# EAGLE design ELEC327_V3 (EAGLE 9.6.2)

## Sheet 1 of 2

## Sheet 2 of 2
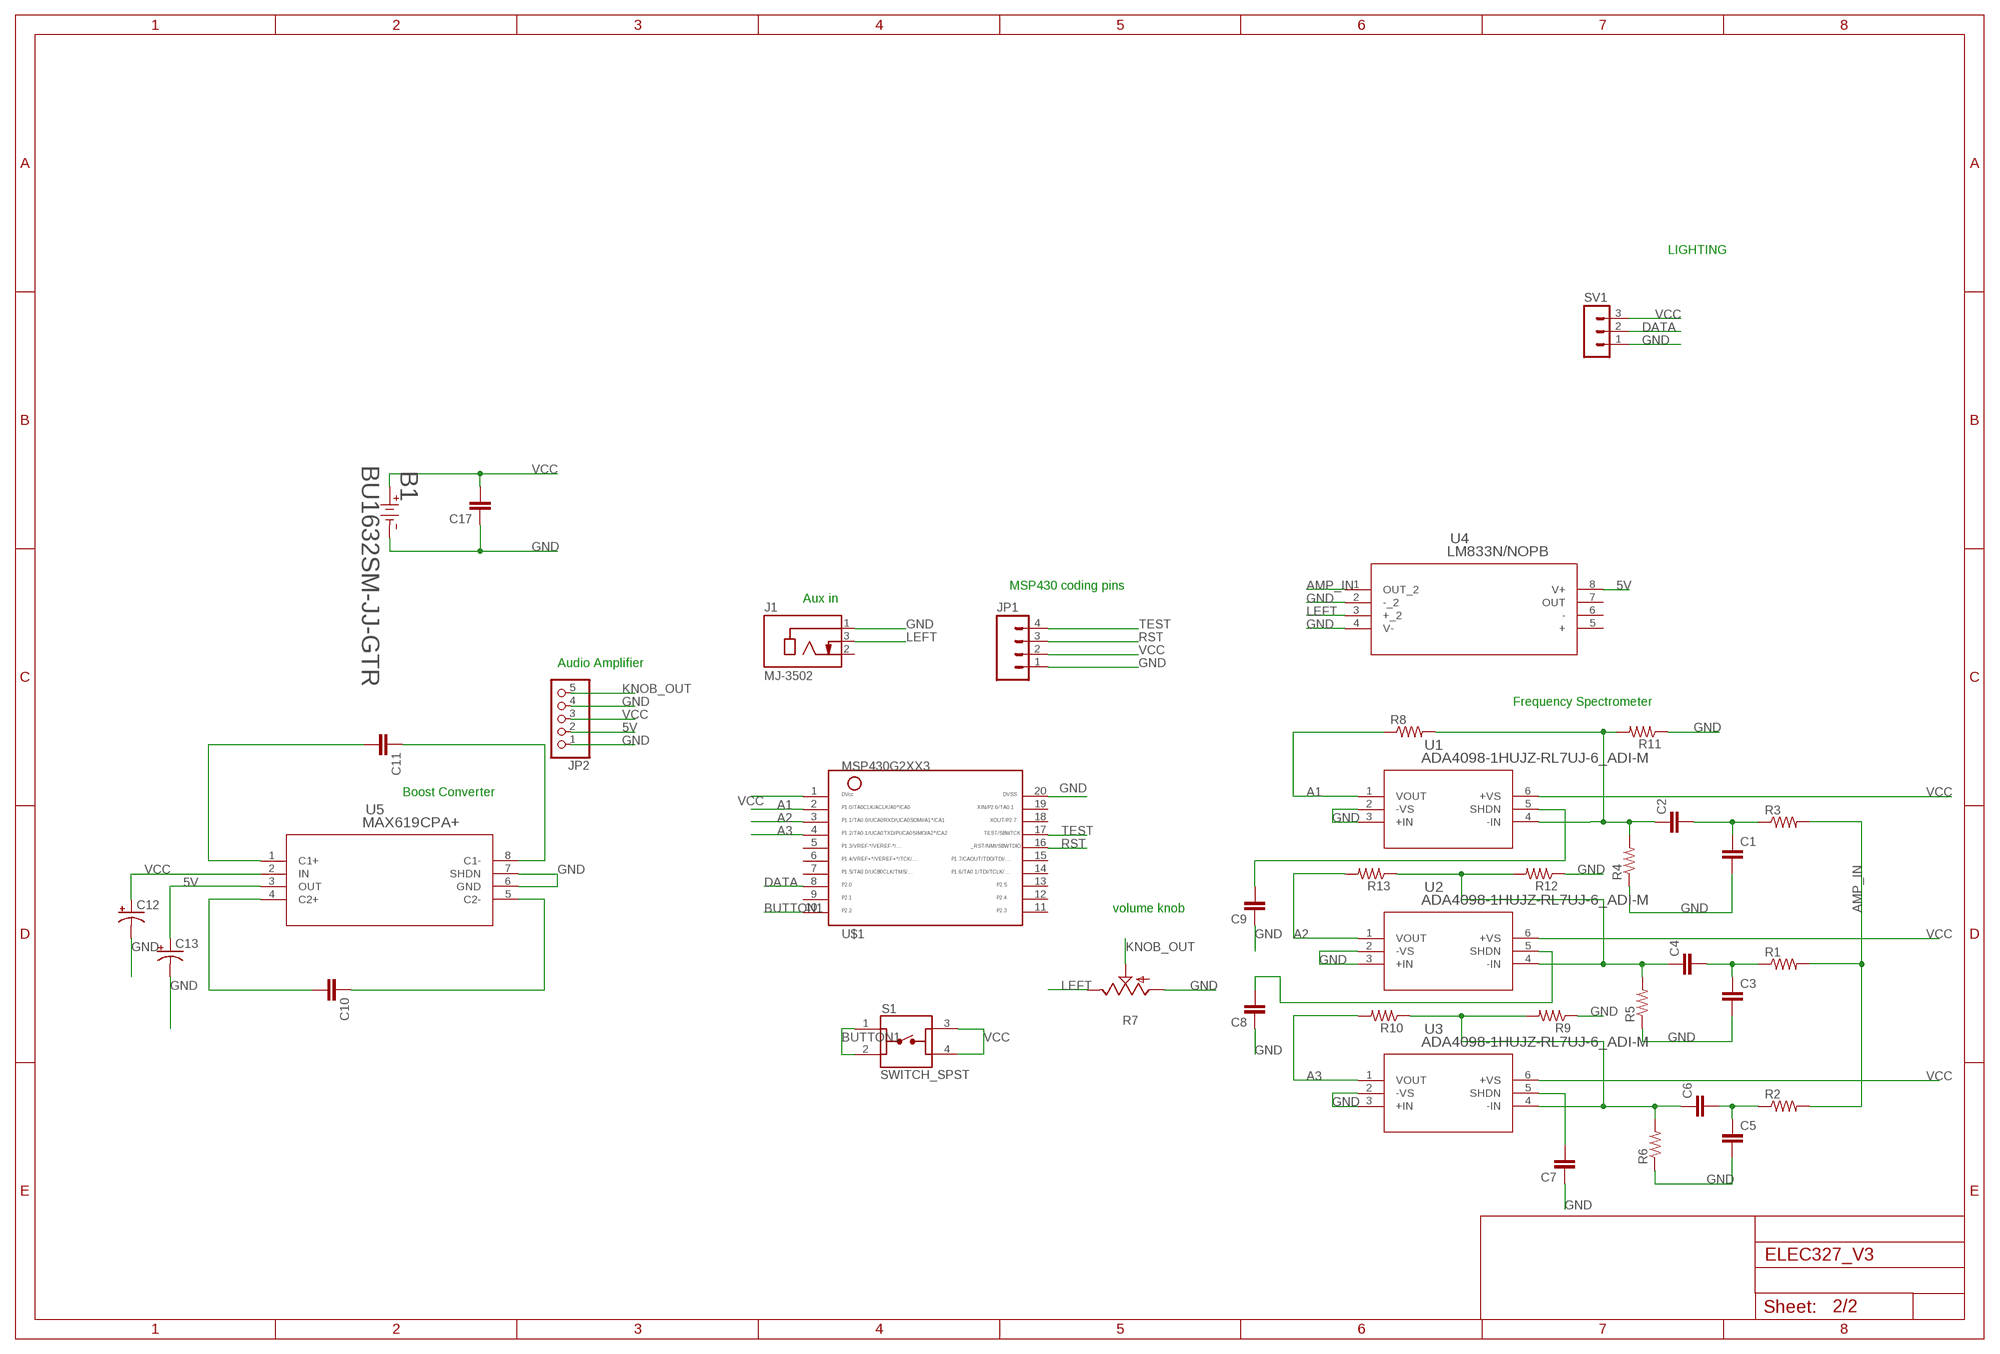
[diagram p0: schematic, sheet 2]

### Parts
B1  BU1632SM-JJ-GTR  [BU1632SM-JJ-GTR_MPD]
C1  C-EUC1206  [C1206]
C2  C-EUC1206  [C1206]
C3  C-EUC1206  [C1206]
C4  C-EUC1206  [C1206]
C5  C-EUC1206  [C1206]
C6  C-EUC1206  [C1206]
C7  C-EUC1206  [C1206]
C8  C-EUC1206  [C1206]
C9  C-EUC1206  [C1206]
C10  C-EUC1206  [C1206]
C11  C-EUC1206  [C1206]
C12  CPOL-USE5-6  [E5-6]
C13  CPOL-USE5-6  [E5-6]
C17  C-EUC1206  [C1206]
J1  MJ-3502  [CUI_MJ-3502]
JP1  HEADER_1X04LOCK  [1X04_LOCK]
JP2  PINHD-1X55X2MM  [1_05X2MM]
R1  R-US_R1206  [R1206]
R2  R-US_R1206  [R1206]
R3  R-US_R1206  [R1206]
R4  R-US_R1206  [R1206]
R5  R-US_R1206  [R1206]
R6  R-US_R1206  [R1206]
R7  TRIM_US-B25X  [B25X]
R8  R-US_R1206  [R1206]
R9  R-US_R1206  [R1206]
R10  R-US_R1206  [R1206]
R11  R-US_R1206  [R1206]
R12  R-US_R1206  [R1206]
R13  R-US_R1206  [R1206]
S1  SWITCH_SPST  [SW_1825910-7]
SV1  MA03-1  [MA03-1]
U1  ADA4098-1HUJZ-RL7UJ-6_ADI-M  [UJ-6_ADI-M]
U2  ADA4098-1HUJZ-RL7UJ-6_ADI-M  [UJ-6_ADI-M]
U3  ADA4098-1HUJZ-RL7UJ-6_ADI-M  [UJ-6_ADI-M]
U4  LM833N/NOPB  [N08E_TEX]
U5  MAX619CPA+  [21-0043D_8_MXM]
U$1  MSP430G2XX3TSSOP  [PW20]

### Nets
5V: C13.+ JP2.2 U4.8(V+) U5.3(OUT)
A1: R8.1 U1.1(VOUT) U$1.2
A2: R13.2 U2.1(VOUT) U$1.3
A3: R10.2 U3.1(VOUT) U$1.4
AMP_IN: R1.2 R2.2 R3.2 U4.1(OUT_2)
BUTTON1: S1.1 S1.2 U$1.10
DATA: SV1.2 U$1.8
GND: B1.2 C1.2 C3.2 C5.2 C7.1 C8.1 C9.1 C12.- C13.- C17.1 J1.1 JP1.1 JP2.1 JP2.4 R4.1 R5.1 R6.1 R7.A R9.1 R11.1 R12.1 SV1.1 U1.2(-VS) U1.3(+IN) U2.2(-VS) U2.3(+IN) U3.2(-VS) U3.3(+IN) U4.2(-_2) U4.4(V-) U5.6(GND) U5.7(SHDN) U$1.20
KNOB_OUT: JP2.5 R7.S
LEFT: J1.3 R7.E U4.3(+_2)
N$1: C2.1 R4.2 R8.2 R11.2 U1.4(-IN)
N$2: C1.1 C2.2 R3.1
N$3: C3.1 C4.2 R1.1
N$4: C5.1 C6.2 R2.1
N$5: C4.1 R5.2 R12.2 R13.1 U2.4(-IN)
N$6: C7.2 U3.5(SHDN)
N$7: C6.1 R6.2 R9.2 R10.1 U3.4(-IN)
N$8: C8.2 U2.5(SHDN)
N$9: C9.2 U1.5(SHDN)
N$10: C10.2 U5.4(C2+)
N$11: C10.1 U5.5(C2-)
N$12: C11.2 U5.1(C1+)
N$13: C11.1 U5.8(C1-)
RST: JP1.3 U$1.16
TEST: JP1.4 U$1.17
VCC: B1.1 C12.+ C17.2 JP1.2 JP2.3 S1.3 S1.4 SV1.3 U1.6(+VS) U2.6(+VS) U3.6(+VS) U5.2(IN) U$1.1
Unconnected: J1.2 U4.5(+) U4.6(-) U4.7(OUT) U$1.5 U$1.6 U$1.7 U$1.9 U$1.11 U$1.12 U$1.13 U$1.14 U$1.15 U$1.18 U$1.19

### Notes on the sheet
- LIGHTING
- MSP430 coding pins
- Aux in
- Audio Amplifier
- Frequency Spectrometer
- Boost Converter
- volume knob

## Library data of the parts
B1 = ELEC327:BU1632SM-JJ-GTR; COPYRIGHT: Copyright (C) 2023 Ultra Librarian. All rights reserved.; MANUFACTURER_PART_NUMBER: BU1632SM-JJ-GTR; MFR_NAME: Memory Protection Devices
C1-C11 C17 = rcl:C-EU: CAPACITOR, European symbol; SPICEPREFIX: C
C12 C13 = rcl:CPOL-US: POLARIZED CAPACITOR, American symbol; SPICEPREFIX: C
J1 = MJ-3502:MJ-3502: 3.5 mm, Mono, Right Angle, Through Hole, Threaded Bushing, Audio Jack Connector; MANUFACTURER: CUI INC; PART_REV: A; STANDARD: MANUFACTURER RECOMMENDATIONS
JP1 = ELEC327:HEADER_1X04: Header 4 Standard 4-pin 0.1" header. Use with straight break away headers (SKU : PRT-00116), right angle break away headers (PRT-00553), swiss pins (PRT-00743), machine pins (PRT-00117), and female headers (PRT-00115). Molex polarized connector foot print use with SKU : PRT-08231 with associated crimp pins and housings.
JP2 = pinhead:PINHD-1X5: PIN HEADER
R1-R6 R8-R13 = rcl:R-US_: RESISTOR, American symbol; SPICEPREFIX: R
R7 = pot:TRIM_US-: POTENTIOMETER
S1 = ELEC327:SWITCH_SPST: TE Connectivity Alcoswitch, 6mm Switch Tactile OFF (ON) SPST Round Button PC Pins 0.05A 24VDC 100000Cycles 2.55N Thru-Hole Loose Through Hole Version 1825910-7 <https://www.digikey.com/en/products/detail/te-connectivity-alcoswitch-switches/1825910-7/1731414> Surface Mount Version 1571563-4 <https://www.digikey.com/en/products/detail/te-connectivity-alcoswitch-switches/1571563-4/2400231>; COMMENT: 1825910-7; CONFIGURATION_POLE-THROW: Single Pole - Single Throw; CONTACT_CURRENT_RATING: 50 mA; DESCRIPTION: Switch Tactile OFF (ON) SPST Round Button PC Pins 0.05A 24VDC 100000Cycle 2.55N Thru-Hole Loose Piece; DIGI-KEY_PART_NUMBER: 450-1804-ND; EU_ROHS_COMPLIANCE: Compliant; MF: TE Connectivity; MP: 1825910-7; PACKAGE: None; PURCHASE-URL: https://pricing.snapeda.com/search/part/1825910-7/?ref=eda
SV1 = con-lstb:MA03-1: PIN HEADER; OC_FARNELL: unknown; OC_NEWARK: unknown
U1-U3 = ADA4098:ADA4098-1HUJZ-RL7; COPYRIGHT: Copyright (C) 2023 Ultra Librarian. All rights reserved.; MANUFACTURER_PART_NUMBER: ADA4098-1HUJZ-RL7; MFR_NAME: Analog Devices Inc
U4 = LM833N:LM833N/NOPB; COPYRIGHT: Copyright (C) 2023 Ultra Librarian. All rights reserved.; MANUFACTURER_PART_NUMBER: LM833N/NOPB; MFR_NAME: Texas Instruments
U5 = ul_MAX619CPA-:MAX619CPA+; COPYRIGHT: Copyright (C) 2023 Ultra Librarian. All rights reserved.; MANUFACTURER_PART_NUMBER: MAX619CPA+; MFR_NAME: Analog Devices Inc
U$1 = ELEC327:MSP430G2XX3: MSP430G2XX3 PDIP (N) 20 Pin Package

## Board
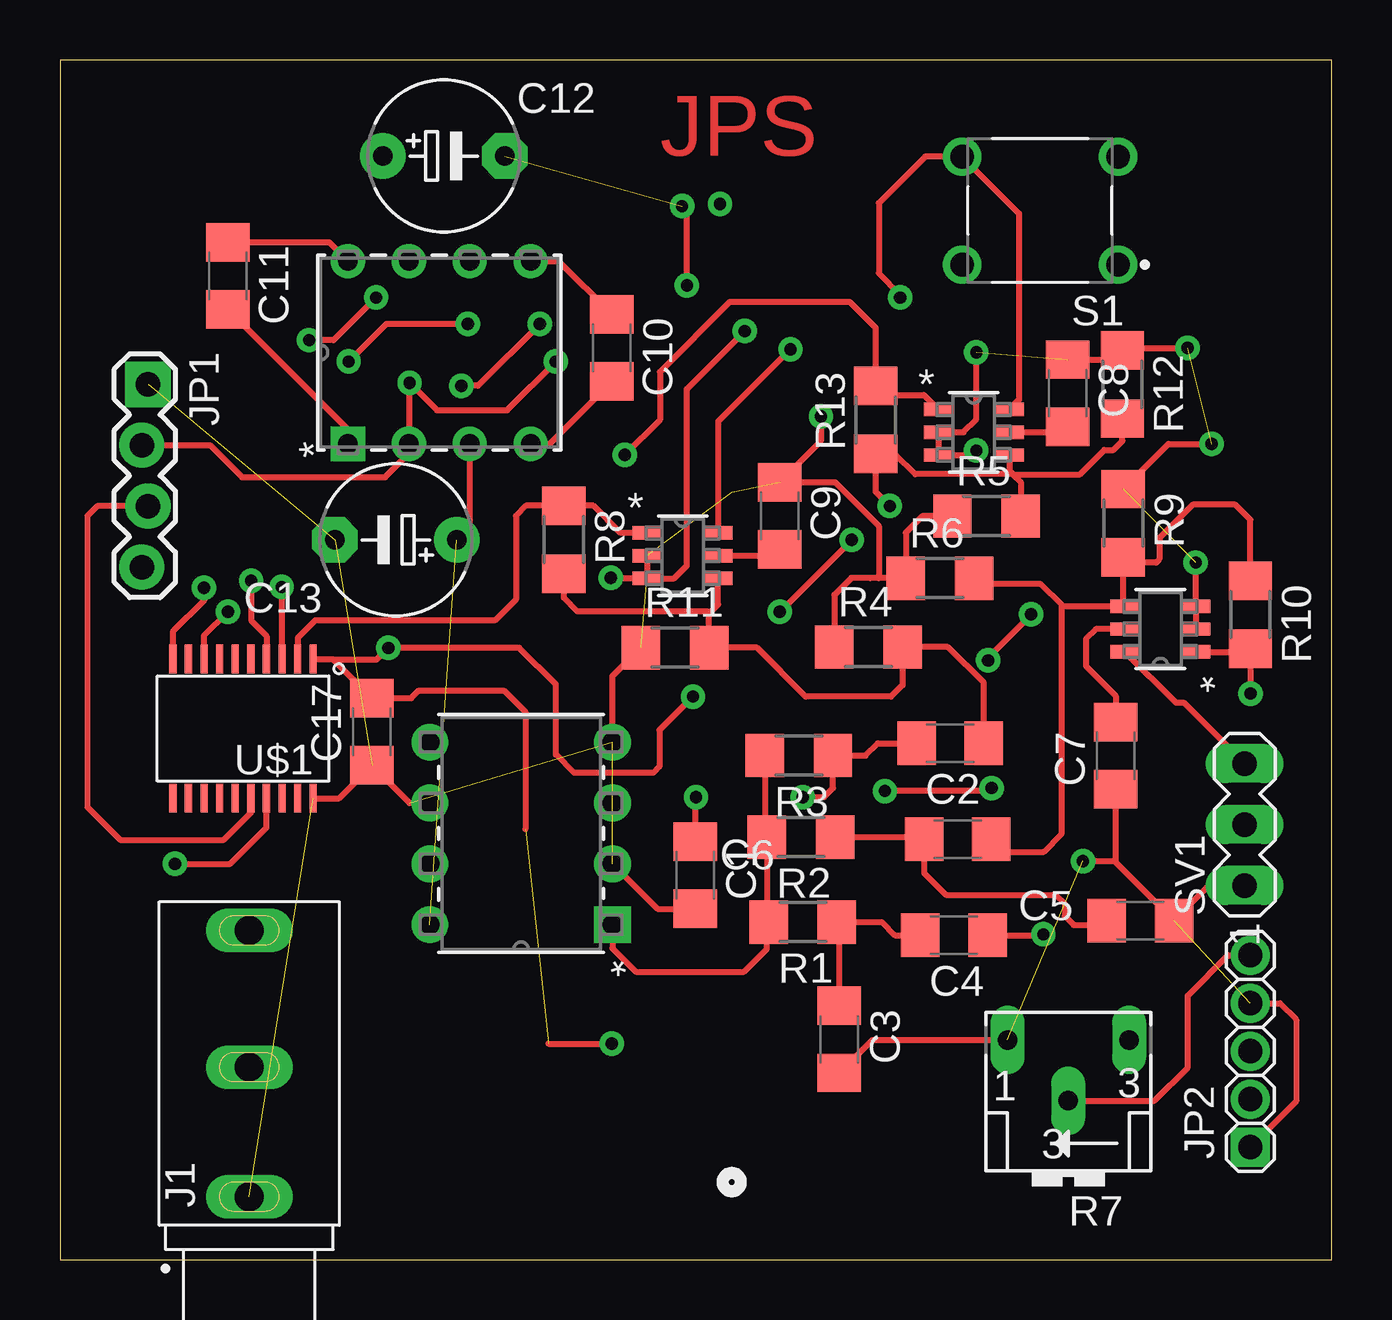
[diagram p1: board, top side]
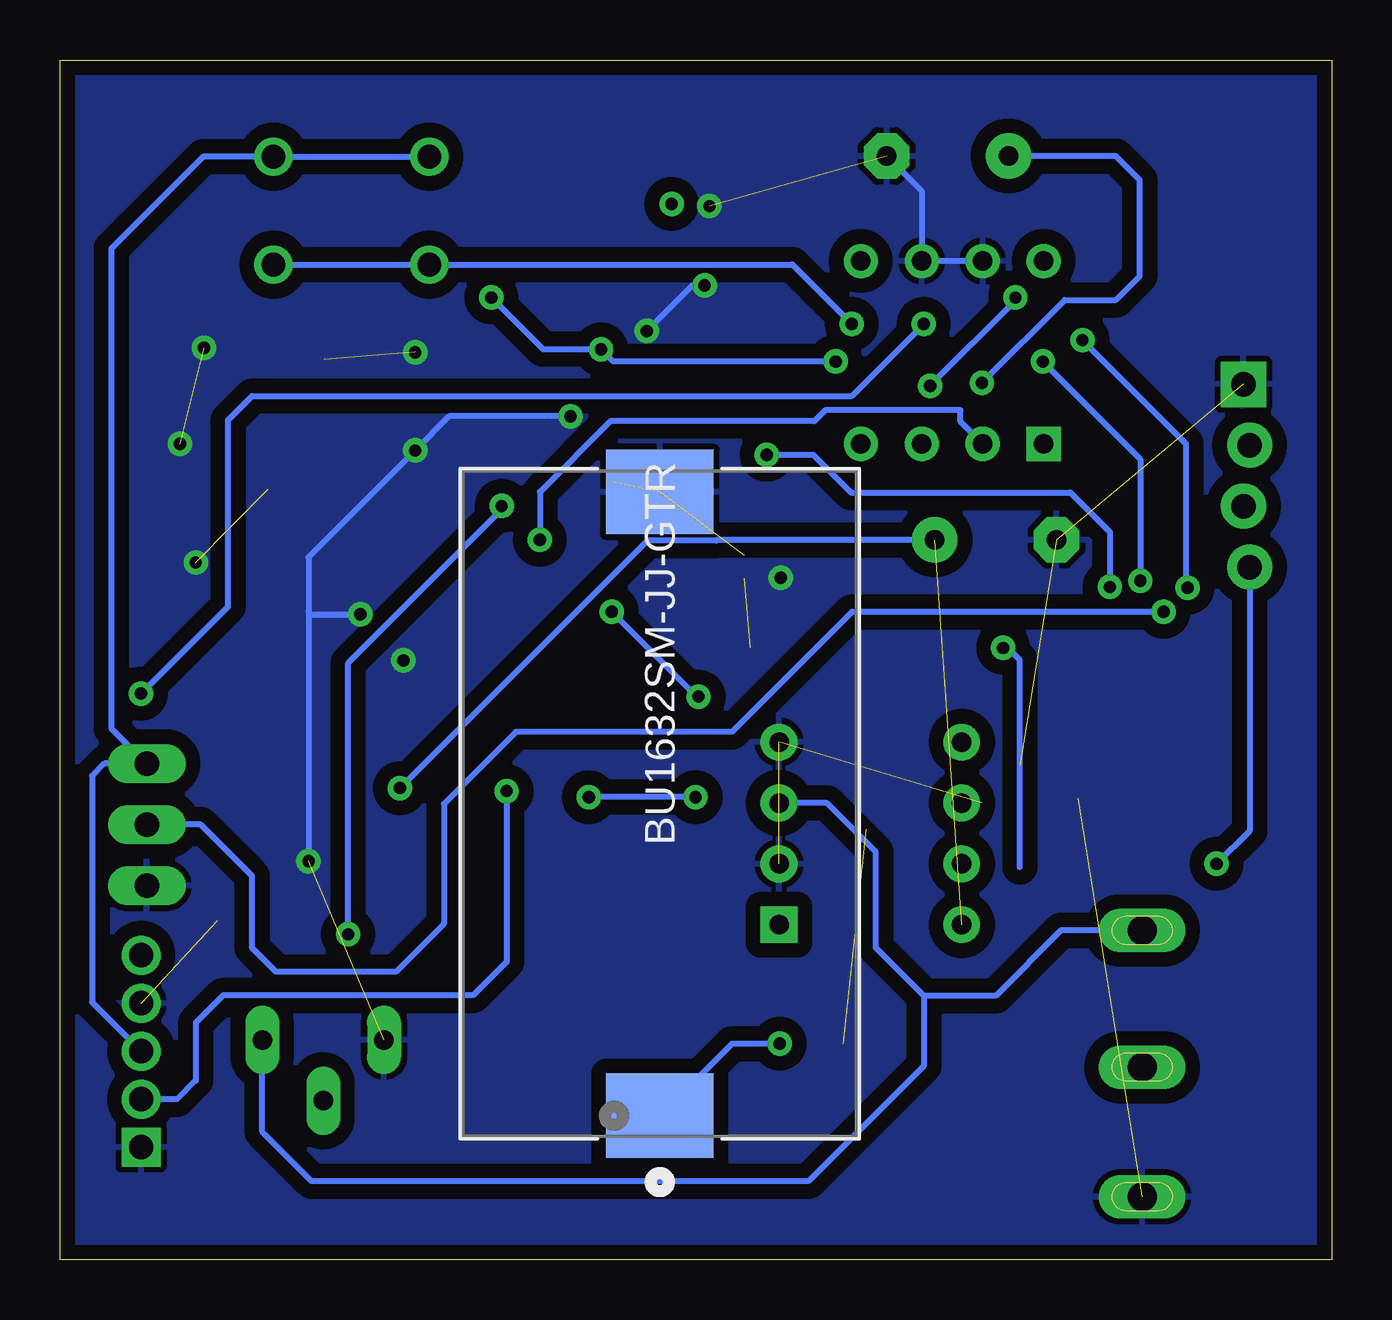
[diagram p2: board, bottom side, seen from below]

Size 53 x 50 mm. Coordinates in mm from the lower left corner, seen from the top.
Outline: 0,0 53,0 53,50 0,50 0,0
Copper layers (1*16): Top 0.035mm / dielectric 1.5mm / Bottom 0.035mm
Design rules "AdvancedCircuitsBarebones": minimum track width 6mil, minimum drill 20mil, track to track 6mil, track to pad 6mil, pad to pad 6mil, via to via 6mil, smd to smd 6mil, copper to edge 10mil, drill to drill 6mil, minimum pad ring 12mil, minimum via ring 10mil, stop-mask expansion 4mil, vias tented up to drill 25mil, thermal gap 10mil

### Footprints (pad centres in the part's own frame; a part is rotated, then mirrored left to right if it is on the bottom)
BU1632SM-JJ-GTR_MPD = smd 3.505 x 4.496: 1 -13,0; 2 13,0
C1206 = smd 1.6 x 1.8: 1 -1.4,0; 2 1.4,0
E5-6 = drill 0.813 pad 1.905: + -2.54,0 | drill 0.813 pad 1.905 octagon: - 2.54,0
CUI_MJ-3502 = drill 1.2 long: 1 -5.55,0; 2 -0.15,0; 3 5.55,0
1X04_LOCK = drill 1.016 pad 1.88 square: 1 0,0.127 | drill 1.016 pad 1.88: 2 2.54,-0.127; 3 5.08,0.127; 4 7.62,-0.127
1_05X2MM = drill 1.016 pad 1.3 square: 1 -4,0 | drill 1.016 pad 1.3: 2 -2,0; 3 0,0; 4 2,0; 5 4,0
R1206 = smd 1.6 x 1.803: 1 -1.422,0; 2 1.422,0
B25X = drill 0.813 long: A 2.54,-1.905; E -2.54,-1.905; S 0,0.635
SW_1825910-7 = drill 0.99: 1 -3.25,2.25; 2 3.25,2.25; 3 -3.25,-2.25; 4 3.25,-2.25
MA03-1 = drill 1.016 long: 1 -2.54,0; 2 0,0; 3 2.54,0
UJ-6_ADI-M = smd 1.206 x 0.559: 1 -1.48,0.95; 2 -1.48,0; 3 -1.48,-0.95; 4 1.48,-0.95; 5 1.48,0; 6 1.48,0.95
N08E_TEX = drill 0.813 pad 1.524 square: 1 0,0 | drill 0.813 pad 1.524: 2 0,-2.54; 3 0,-5.08; 4 0,-7.62; 5 7.62,-7.62; 6 7.62,-5.08; 7 7.62,-2.54; 8 7.62,0
21-0043D_8_MXM = drill 0.813 pad 1.321 square: 1 0,0 | drill 0.813 pad 1.321: 2 0,-2.54; 3 0,-5.08; 4 0,-7.62; 5 7.62,-7.62; 6 7.62,-5.08; 7 7.62,-2.54; 8 7.62,0
PW20 = smd 0.3 x 1.2: 1 -2.925,-2.9; 2 -2.275,-2.9; 3 -1.625,-2.9; 4 -0.975,-2.9; 5 -0.325,-2.9; 6 0.325,-2.9; 7 0.975,-2.9; 8 1.625,-2.9; 9 2.275,-2.9; 10 2.925,-2.9; 11 2.925,2.9; 12 2.275,2.9; 13 1.625,2.9; 14 0.975,2.9; 15 0.325,2.9; 16 -0.325,2.9; 17 -0.975,2.9; 18 -1.625,2.9; 19 -2.275,2.9; 20 -2.925,2.9

### Placement (x,y rotation side)
B1  28,19 90 bottom
C1  26.48,16.02 270 top
C2  37.1,21.52 180 top
C3  32.48,9.18 270 top
C4  37.26,13.52 180 top
C5  45.03,14.13 0 top
C6  37.42,17.52 180 top
C7  44,21 90 top
C8  42,36.11 270 top
C9  30,31 270 top
C10  23,38 270 top
C11  7,41 270 top
C12  16,46 0 top
C13  14,30 180 top
C17  13,22 90 top
J1  7.89,8.17 90 top
JP1  3.54,36.48 270 top
JP2  49.62,8.68 90 top
R1  30.96,14.06 180 top
R2  30.89,17.61 180 top
R3  30.8,21.01 180 top
R4  33.7,25.53 0 top
R5  38.62,30.99 0 top
R6  36.67,28.4 0 top
R7  42.03,7.25 180 top
R8  21,30 270 top
R9  44.31,30.69 270 top
R10  49.62,26.87 270 top
R11  25.64,25.5 0 top
R12  44.28,36.47 270 top
R13  34,35 90 top
S1  40.85,43.72 180 top
SV1  49.38,18.13 90 top
U1  25.96,29.34 0 top
U2  38.08,34.48 0 top
U3  45.87,26.28 180 top
U4  23.03,13.95 180 top
U5  12,34 90 top
U$1  7.63,22.13 180 top

### Tracks (layer width: path | path; a pad name or v marks a point on that pad's centre or on a via)
5V  (via drill 0.51)  (1 unrouted)
  Top 0.254: U5.3 17.08,30.54 C13.+ | v38.83,19.65 38.7,19.53 v34.38,19.53
  Bottom 0.254: C13.+ 25.6,30 25.64,29.97 28.52,29.97 v38.83,19.65 | v34.38,19.53 34.38,12.41 35.78,11.02 46.2,11.02 47.34,9.87 47.34,7.46 48.12,6.68 JP2.2
A1
  Top 0.254: U1.1 23.37,30.29 22.23,31.42 R8.1 19.42,31.42 19,31 19,27.51 18.13,26.64 10.64,26.64 9.91,25.91 U$1.2
A2  (via drill 0.51)
  Top 0.254: v9.24,28.04 9.24,25.05 U$1.3 | U2.1 36,36.04 34.39,36.04 R13.2 34,38.83 32.92,39.91 27.91,39.91 25,37 25,35 v23.54,33.54
  Bottom 0.254: v23.54,33.54 21.61,33.54 20.03,31.97 10.89,31.97 9.24,30.32 v9.24,28.04
A3  (via drill 0.51)
  Top 0.254: U3.1 49.5,25.33 R10.2 v49.62,23.6 v49.62,23.59 | v17,39 13.6,39 v12.03,37.43 | v7.97,28.29 7.97,26.64 8.61,26 U$1.4
  Bottom 0.254: v49.62,23.59 46,27.21 46,35 45,36 20,36 v17,39 | v12.03,37.43 7.97,33.37 v7.97,28.29
AMP_IN
  Top 0.254: R3.2 29.38,17.7 R2.2 29.46,14.13 | 29.46,14.13 R1.2 | U4.1 23.03,12.97 24,12 28.51,12 29.46,12.95 29.46,14.13
BUTTON1  (via drill 0.51)
  Top 0.254: v20,39 17.42,36.42 v16.73,36.42 | v13.18,40.1 11.4,38.32 v10.38,38.32 | v6,28 6,27.46 4.71,26.17 U$1.10
  Bottom 0.254: S1.1 S1.2 22.47,41.47 v20,39 | v16.73,36.42 13.18,39.97 v13.18,40.1 | v10.38,38.32 6.06,34 6.06,28.06 v6,28
DATA  (via drill 0.51)
  Top 0.254: U$1.8 6.01,26.01 v7,27
  Bottom 0.254: v7,27 20,27 25,22 34,22 37,19 37,14 39,12 44,12 45,13 45,16 47.13,18.13 SV1.2
GND  (via drill 0.51)  (14 unrouted)
  Top 0.254: R5.1 35.94,30.99 35.25,30.3 R6.1 34.13,28.4 | 34.13,28.4 33.77,28.4 33.75,28.42 32.99,28.42 32.27,27.7 R4.1 | U1.2 U1.3 | U1.3 22.98,28.39 v22.95,28.42 | U3.2 U3.3 v47.35,29.04 v47.34,29.05 | C8.1 43.9,37.51 R12.1 44.39,38 v47,38 | U$1.20 11.63,19.23 C17.1 14.57,19.03 | U4.2 24.9,14.62 C1.2 | U4.4 23.03,24.32 R11.1 | C3.2 33.86,9.16 R7.A | JP2.4 50.85,10.68 51.53,10 51.53,6.6 JP2.1 | 44,16.56 C5.2 47.89,15.59 SV1.1 | 44,16.56 C7.1 | R9.1 46.2,34 v48,34 | v38.2,33.73 38,33.53 U2.3 U2.2 37.66,34.48 38.2,35.02 v38.2,37.81 | 34.13,28.4 34.13,30.57 32.31,32.4 C9.1 31.72,34.12 v31.72,35.15 | U1.3 25.59,28.39 26.13,28.92 26.13,36.29 v28.54,38.7 | v26.13,40.61 26.13,43.71 v25.93,43.91 | v42.64,16.61 43.95,16.61 44,16.56 | v40.48,26.89 38.69,25.1 v38.69,24.97
  Bottom 0.254: C12.- 17.08,44.54 17.08,42 | 17.08,42 U5.6 | U5.7 16.7,41.62 17.08,42 | 42.64,27 42.64,29.28 v38.2,33.73 36.77,35.15 v31.72,35.15 | 42.64,27 v42.64,16.61 | v28.54,38.7 26.64,40.61 v26.13,40.61 | 42.64,27 42.53,26.89 v40.48,26.89
  pour Bottom (isolate 0.61): 0,50 53,50 53,0 0,0 0,5
KNOB_OUT
  Top 0.254: R7.S 45.62,6.62 47,8 47,11 48.68,12.68 JP2.5
LEFT
  Bottom 0.254: J1.3 11.28,13.72 14,11 17,11 | U4.3 21.03,19.03 19,17 19,13 17,11 | 17,11 17,8.08 21.81,3.27 42.51,3.27 44.57,5.33 R7.E
N$1
  Top 0.254: C2.1 38.5,24.05 37.02,25.53 R4.2 35.12,23.94 34.64,23.46 31.08,23.46 29.04,25.5 R11.2 27.06,26.93 | U1.4 27.44,27.31 27.06,26.93 | 27.06,26.93 26.97,27.02 21.56,27.02 21,27.58 R8.2
N$2  (via drill 0.51)
  Top 0.254: C2.2 34.09,21.52 33.58,21.01 R3.1 32.22,19.65 31.84,19.27 v30.96,19.27 | C1.1 26.48,19.24 v26.51,19.27
  Bottom 0.254: v26.51,19.27 v30.96,19.27
N$3
  Top 0.254: R1.1 33,14.06 | 33,14.06 34.26,14.06 34.8,13.52 C4.2 | C3.1 32.48,13.54 33,14.06
N$4
  Top 0.152: 35.93,17.61 C6.2
  Top 0.254: R2.1 35.93,17.61 | C6.2 36.02,16.11 36.92,15.21 41.5,15.21 41.88,14.83 41.88,14.32 42.26,13.94 43.44,13.94 C5.1
N$5  (via drill 0.51)
  Top 0.254: U2.4 39.56,32.89 39.72,32.73 | R5.2 40.04,32.41 39.73,32.73 | 39.73,32.73 42.51,32.73 43.53,33.75 43.91,33.75 44.28,34.12 R12.2 | 39.73,32.73 39.72,32.73 | 39.72,32.73 35.66,32.73 34.81,33.58 R13.1 34,32 v34.59,31.41 | C4.1 40.95,13.52 v40.99,13.56
  Bottom 0.254: v40.99,13.56 40.99,24.86 34.51,31.34 v34.59,31.41
N$6
  Top 0.254: U3.5 43.17,26.28 42.77,25.88 42.77,25 42.77,24.86 42.77,24.73 44,23.5 C7.2
N$7
  Top 0.152: C6.1 39.34,17 | 38.33,28.16 R6.2
  Top 0.254: 39.34,17 41,17 41.75,17.75 41.75,27.27 | 41.75,27.27 40.86,28.16 38.33,28.16 | 41.75,27.27 41.79,27.23 U3.4 44.31,27.31 R9.2 44.53,29.05 45.69,29.05 45.81,29.18 45.81,30.07 47.21,31.46 48.99,31.46 49.62,30.84 R10.1
N$8
  Top 0.254: U2.5 41.77,34.48 C8.2
N$9
  Top 0.254: U1.5 29.74,29.34 C9.2
N$10
  Top 0.254: U5.4 20.4,34 C10.2
N$11
  Top 0.254: U5.5 20.78,41.62 C10.1
N$12
  Top 0.254: C11.2 12,34.6 U5.1
N$13
  Top 0.254: C11.1 11.22,42.4 U5.8
N$14  (via drill 0.51)
  other vias: 27.51,44
RST
  Top 0.254: JP1.3 1.54,31.4 1.14,31 1.14,18.86 2.51,17.49 6.83,17.49 7.96,18.62 U$1.16
TEST  (via drill 0.51)
  Top 0.254: v4.79,16.49 7.1,16.49 8.61,18 U$1.17
  Bottom 0.254: JP1.4 3.41,17.88 v4.79,16.49
VCC  (via drill 0.51)  (1 unrouted)
  Top 0.254: U$1.1 11.37,25.03 11.4,24.99 | 11.4,24.99 C17.2 14.64,23.4 14.95,23.72 18.51,23.72 19.4,22.83 19.4,17.94 | JP1.2 6.25,33.94 7.59,32.61 13.56,32.61 14.54,33.59 U5.2 14.57,34.03 v14.57,36.54 15.72,35.4 18.64,35.4 v20.67,37.43 | 20.36,9 v23,9 | U2.6 39.97,35.84 39.97,43.6 S1.4 36.06,45.97 34.13,44.04 34.13,41.12 35.02,40.23 v35.02,40.1 | U3.6 46.51,23.21 46.84,23.21 SV1.3 | v30.45,37.94 27.44,34.93 U1.6 | 11.4,24.99 13.18,24.99 v13.68,25.5 19.14,25.5 20.67,23.97 20.67,21.05 21.43,20.29 24.73,20.29 24.99,20.54 24.99,22.07 v26.38,23.46 | v33,30 v30,27
  Bottom 0.254: v14.57,36.54 11.12,40 9,40 8,41 8,45 9,46 C12.+ | S1.4 S1.3 47.03,45.97 50.86,42.14 50.86,22.14 SV1.3 51.15,20.67 51.66,20.16 51.66,10.73 JP2.3 | v23,9 25,9 B1.1 | v35.02,40.1 32.86,37.94 v30.45,37.94 29.94,37.43 v20.67,37.43 | v13.68,25.5 13.49,25.5 13,25 13,16.36 | v33,30 33,32 30.06,34.94 21.56,34.94 21.1,35.4 15.46,35.4 15.46,34.92 U5.2 | v30,27 26.46,23.46 v26.38,23.46

### Text on the board
Top: JPS